# Altium project Test.PrjPcb
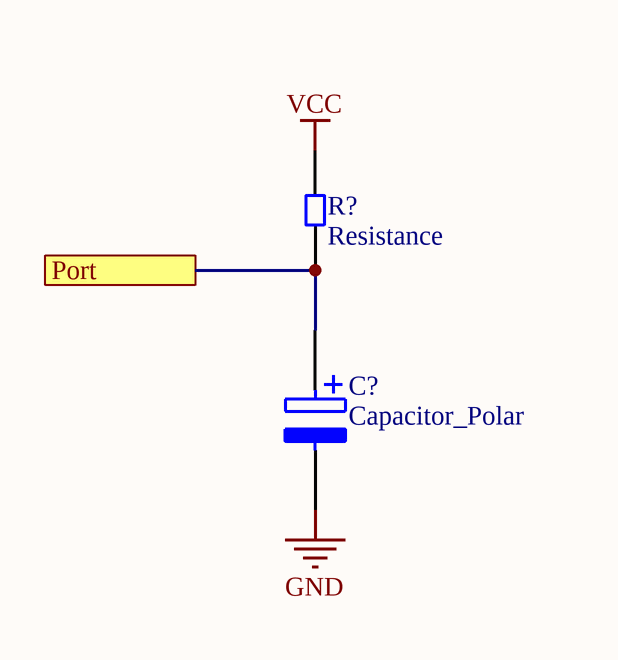
[diagram p0: Sheet2.SchDoc]
1 sheet, 2 parts. Net scope: flat (ports and power ports of the same name join across sheets).

## Sheet Sheet2.SchDoc
size A4; SheetNumber: 2; SheetTotal: 2

### Parts
C?  Capacitor_Polar  [CAP_TANT_CASE_B]
R?  Resistance  [RES_0805]

### Ports
Port

### Nets
GND: C?.2
VCC: R?.2
NetC?_1: C?.1 R?.1 ; port Port

### Library data of the parts
R? = Resistor